# Altium schematic sheet DynStudent.SchDoc
size 420 x 297 mm; DocumentNumber: Динамик; SheetNumber: 4; Format: A3
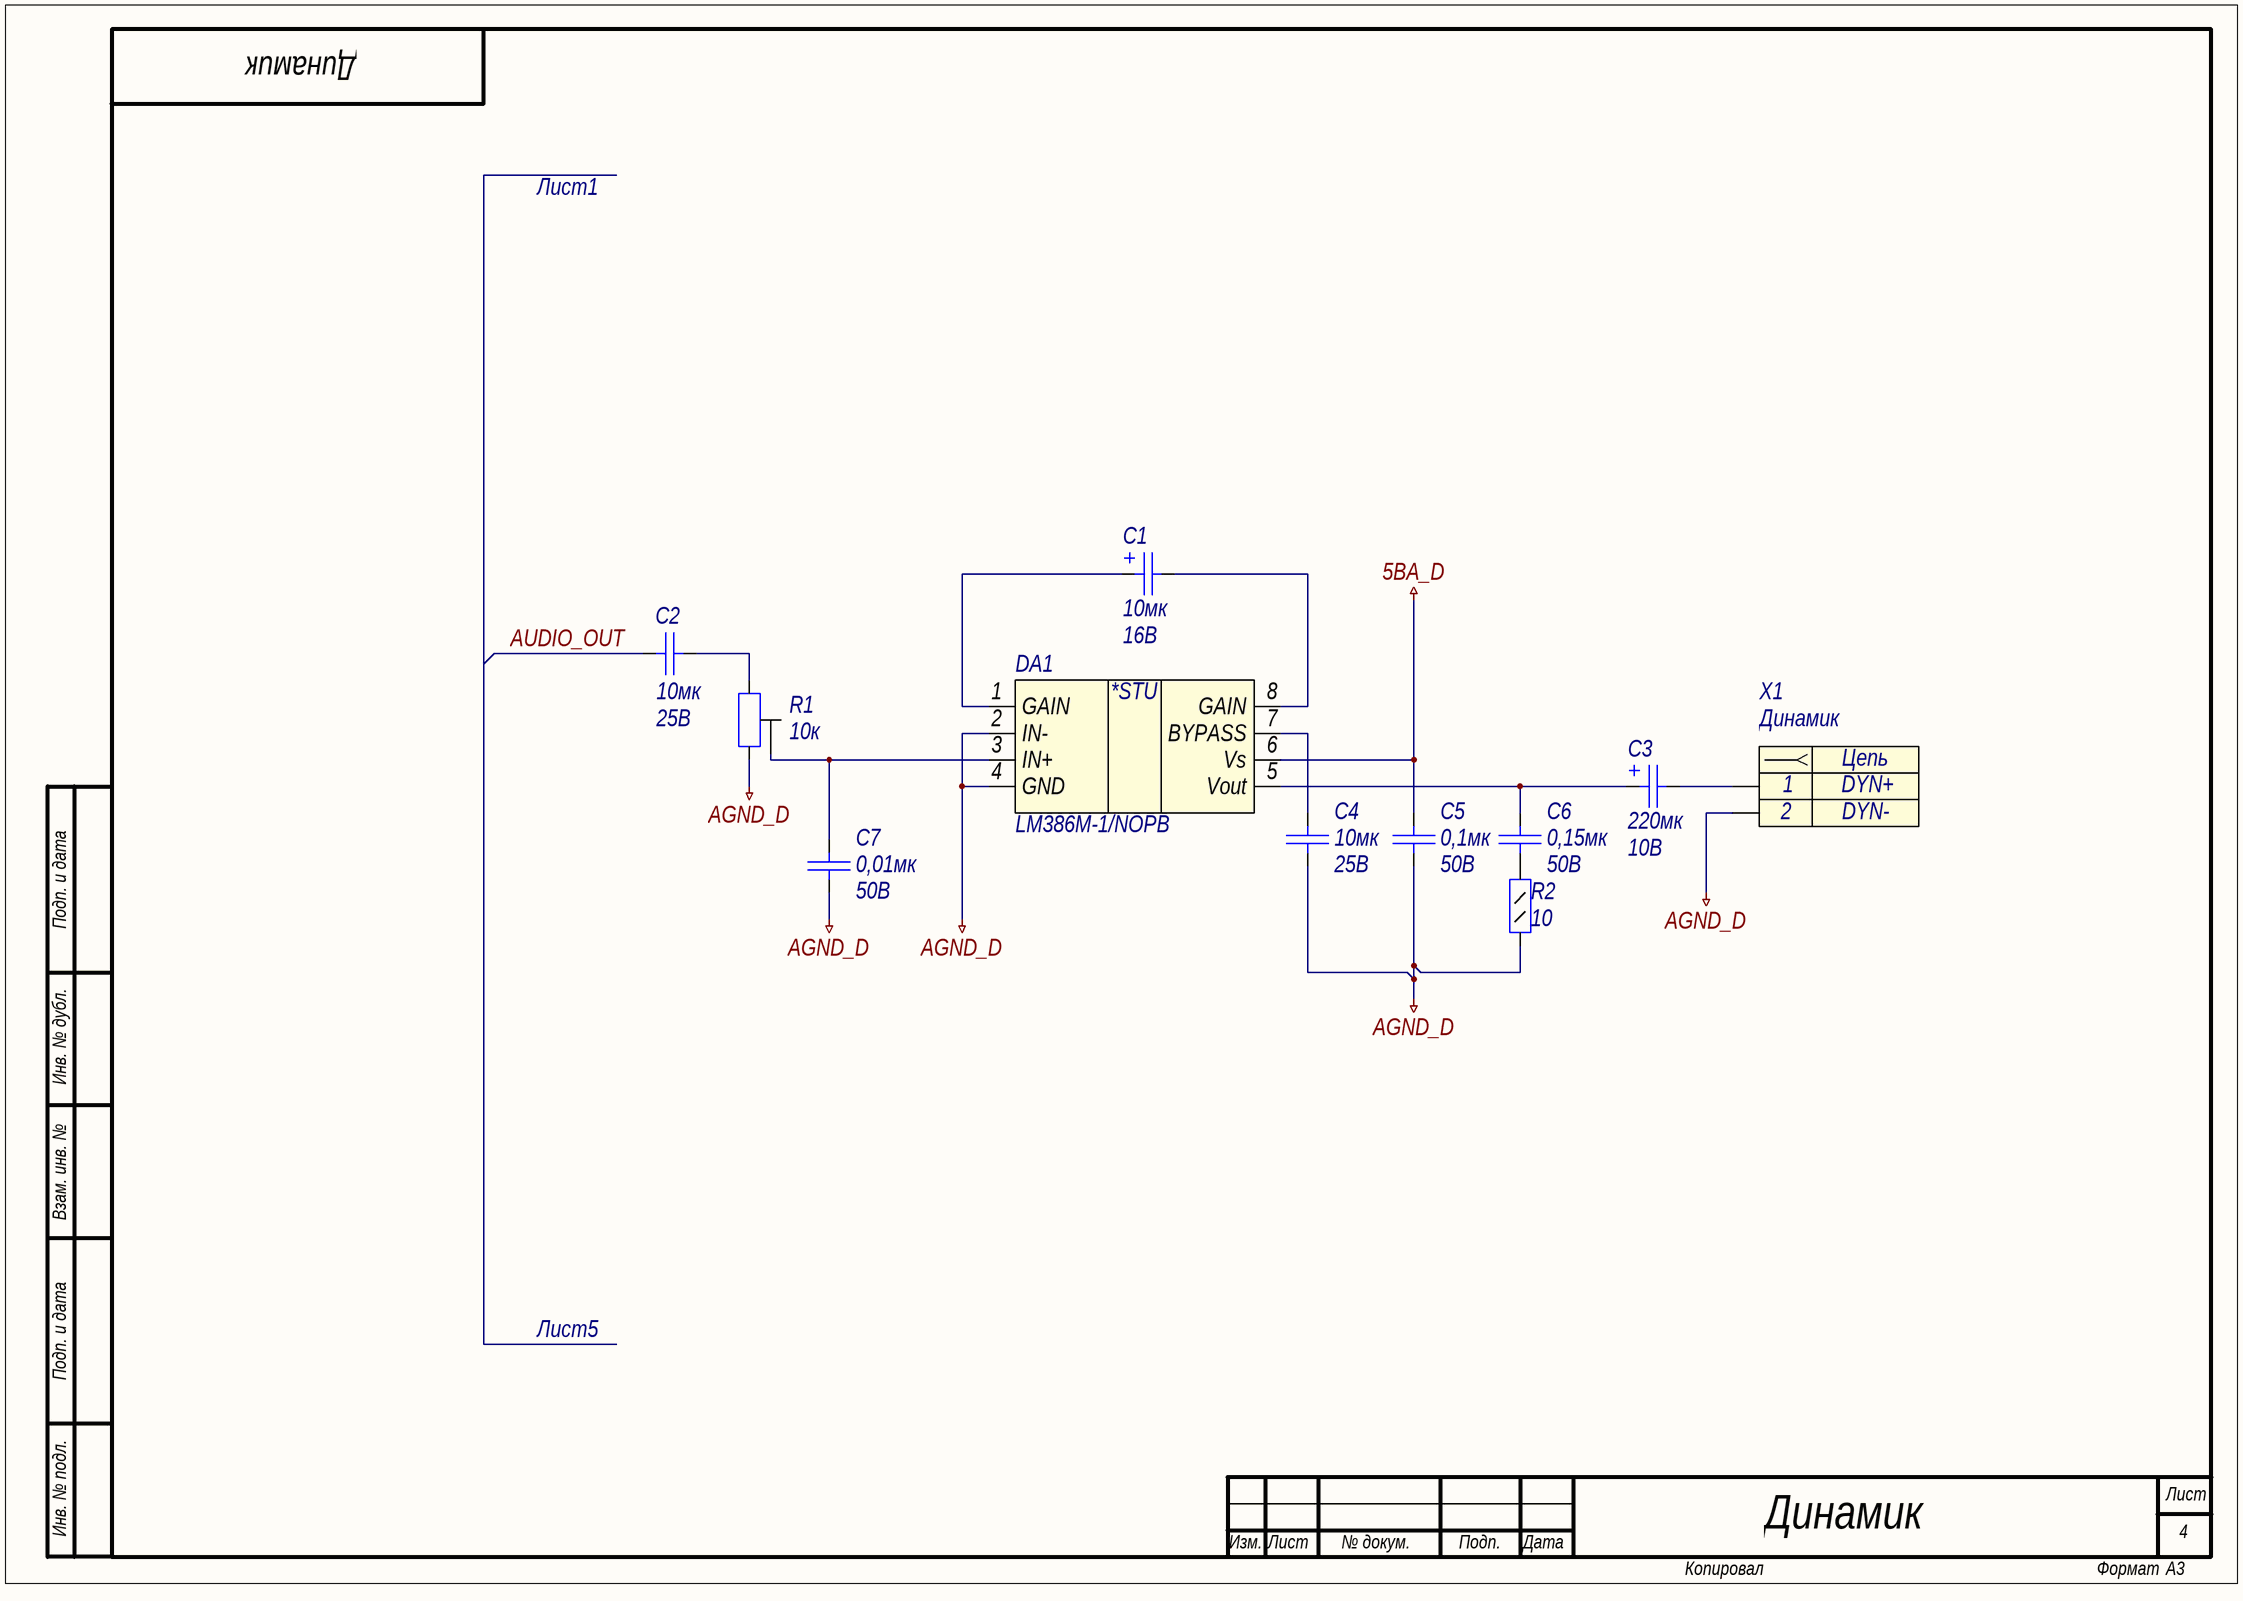
[diagram p0: DynStudent.SchDoc]

## Parts
C1  value 10мк  Voltage: 16В  [TANTAL CASE D]  (hidden comment: Capacitor_pol)
C2  value 10мк  Voltage: 25В  [C1210]  (hidden comment: Capacitor)
C3  value 220мк  Voltage: 10B  [TANTAL CASE D]  (hidden comment: Capacitor_pol)
C4  value 10мк  Voltage: 25В  [C1206]  (hidden comment: Capacitor)
C5  value 0,1мк  Voltage: 50B  [C0805]  (hidden comment: Capacitor)
C6  value 0,15мк  Voltage: 50B  [C0805]  (hidden comment: Capacitor)
C7  value 0,01мк  Voltage: 50B  [C0805]  (hidden comment: Capacitor)
DA1  LM386M-1/NOPB  [SO8]
R1  10к  [Potentiometer]
R2  value 10  [R0805]  (hidden comment: Resistor_0,125Вт)
X1  Динамик  [CWF-2R]

## Nets
5BA_D: C5.2 DA1.6(Vs)
AGND_D: C4.1 C5.1 C7.1 DA1.2(IN-) DA1.4(GND) R1.3 R2.1 X1.2
AUDIO_OUT: C2.1
NetC1_1: C1.1 DA1.1(GAIN)
NetC1_2: C1.2 DA1.8(GAIN)
NetC2_2: C2.2 R1.1
NetC3_1: C3.1 C6.2 DA1.5(Vout)
NetC3_2: C3.2 X1.1
NetC4_2: C4.2 DA1.7(BYPASS)
NetC6_1: C6.1 R2.2
NetC7_2: C7.2 DA1.3(IN+) R1.2

## Notes on the sheet
- Лист1
- Подп. и дата
- Инв. № дубл.
- Взам. инв. №
- Лист5
- Инв. № подл.
- Лист
- Изм.
- № докум.
- Подп.
- Дата
- Копировал
- Формат
- (in symbol connect7) Цепь
- (in symbol LM386M-1/NOPB) *STU

## Library data of the parts
C1 = Polimer: Конденсатор полярный; Part Number: ECASD41C106M060K; TKE: 60mOhm; Part Name: Polimer
C2 = cap193: Конденсатор; Part Name: Ceramic; Manufacture: Murata; Part Number: GRM32ER61A106K; id: cap193; TKE: X7R
C3 = cap192: Конденсатор полярный; Part Name: Tantal; Manufacture: KEMET; Part Number: T491D227K016ZT; id: cap192
C4 = cap186: Конденсатор; Part Name: Ceramic; Manufacture: Murata; Part Number: GRM31CR71E106KA12L*; id: cap186; TKE: X7R
C5 = cap141: Конденсатор; Part Name: Ceramic; Manufacture: Murata; Part Number: GRM21BR71H104K**; id: cap141; TKE: X7R
C6 = cap142: Конденсатор; Part Name: Ceramic; Part Number: GRM21BR71H154K; Manufacture: Murata; id: cap142; TKE: X7R
C7 = cap136: Конденсатор; Part Name: Ceramic; Manufacture: Murata; Part Number: GRM216R71H103K; id: cap136; TKE: X7R
DA1 = LM386M-1/NOPB: Low Voltage Audio Power Amplifier; Bandwidth: 300кГц; Channels: 1; Part Number: LM386M-1/NOPB; Part Name: Audio Power Amplifier
R1 = res1931: Potentiometer; Part Name: Trimming Potentiometer; Part Number: 3302X-3-103; Accuracy: 25%; Power: 0,15Вт; Value: 10к; id: res1931
R2 = res25: Резистор; Manufacture: Yageo; Part Number: RC0805FR-0710RL; id: res25; Accuracy: 0.01; Part Name: Resistor; Power: 0,125Вт
X1 = connect7: Разъем - 2 конт. розетка; Part Name: CWF-2R type A; Part Number: DS1069-2 MR-A; Manufacture: Ningbo connfly electronic; Contact_1: DYN+; Contact_2: DYN-; Etch: 2,5mm; id: connect7